# EAGLE design W104X (EAGLE 6.6.0)
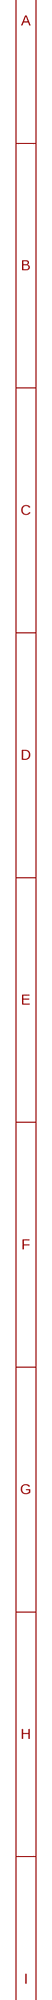
[diagram p0: schematic, sheet 1, part 1 of 2]
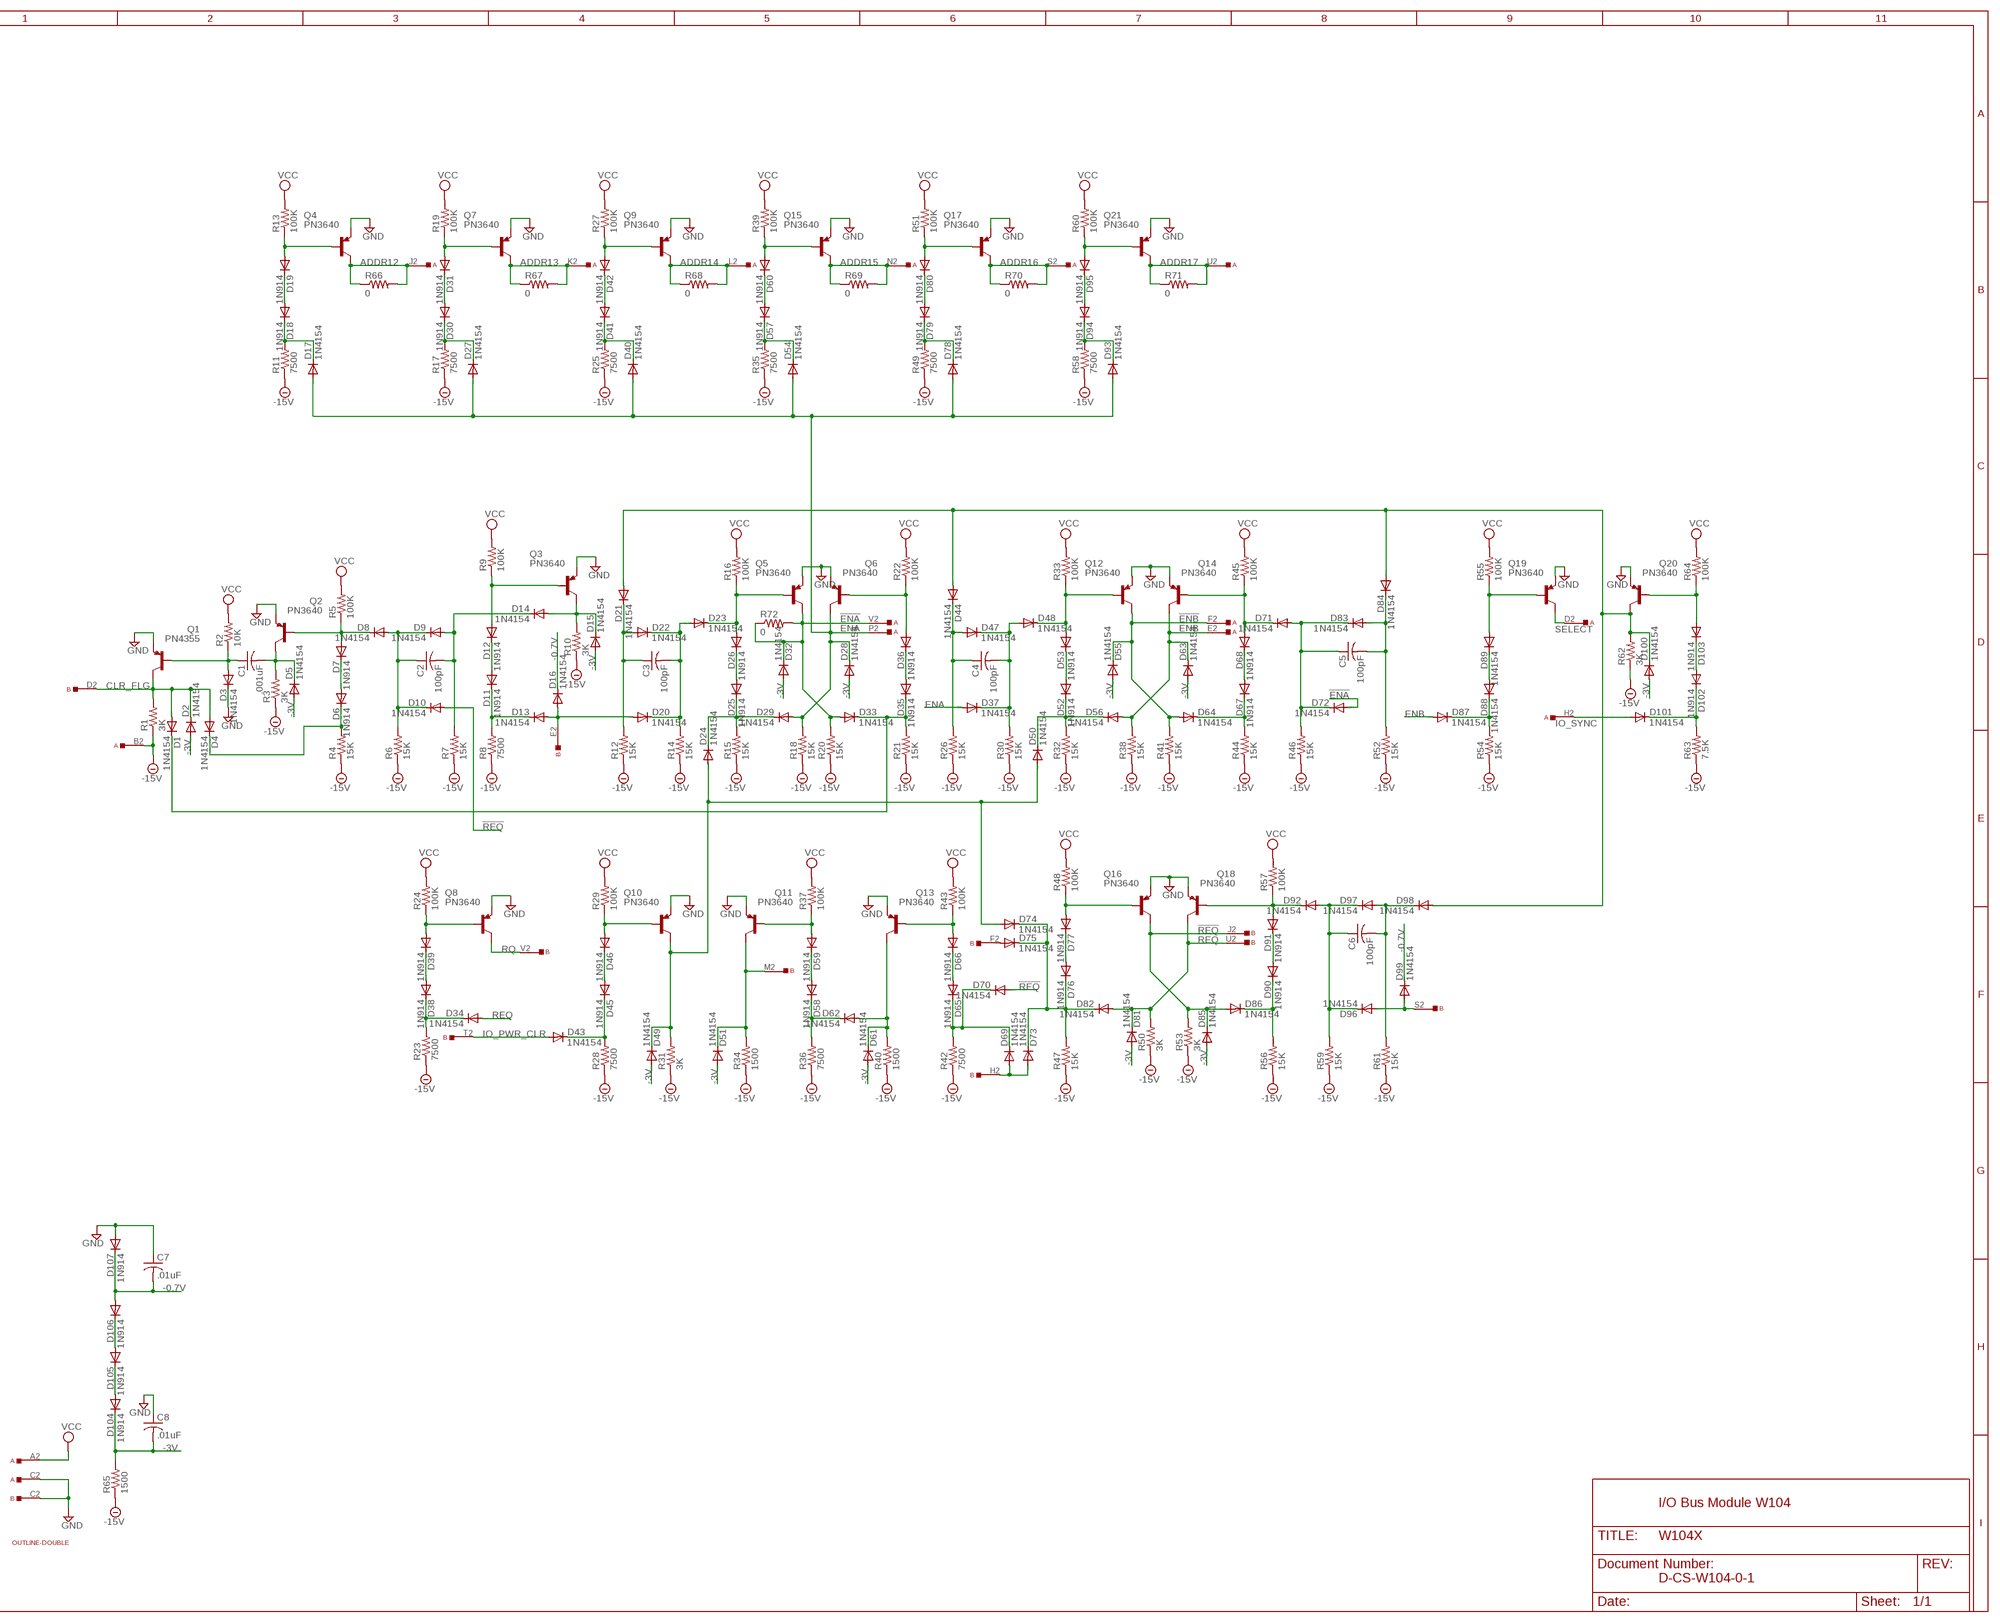
[diagram p1: schematic, sheet 1, part 2 of 2]

## Parts
A  SS-TOP  [EDGE-CON1]
B  SS-TOP  [EDGE-CON1]
C1  .001uF  C-US  [C063-025X075]
C2  100pF  C-US150-054X183  [C150-054X183]
C3  100pF  C-US150-054X183  [C150-054X183]
C4  100pF  C-US150-054X183  [C150-054X183]
C5  100pF  C-US150-054X183  [C150-054X183]
C6  100pF  C-US150-054X183  [C150-054X183]
C7  .01uF  C-US  [C063-025X075]
C8  .01uF  C-US  [C063-025X075]
D1  1N4154  DIODE-DO35-10  [DO35-10]
D2  1N4154  DIODE-DO35-10  [DO35-10]
D3  1N4154  DIODE-DO35-10  [DO35-10]
D4  1N4154  DIODE-DO35-10  [DO35-10]
D5  1N4154  DIODE-DO35-10  [DO35-10]
D6  1N914  DIODE-DO35-10  [DO35-10]
D7  1N914  DIODE-DO35-10  [DO35-10]
D8  1N4154  DIODE-DO35-10  [DO35-10]
D9  1N4154  DIODE-DO35-10  [DO35-10]
D10  1N4154  DIODE-DO35-10  [DO35-10]
D11  1N914  DIODE-DO35-10  [DO35-10]
D12  1N914  DIODE-DO35-10  [DO35-10]
D13  1N4154  DIODE-DO35-10  [DO35-10]
D14  1N4154  DIODE-DO35-10  [DO35-10]
D15  1N4154  DIODE-DO35-10  [DO35-10]
D16  1N4154  DIODE-DO35-10  [DO35-10]
D17  1N4154  DIODE-DO35-10  [DO35-10]
D18  1N914  DIODE-DO35-10  [DO35-10]
D19  1N914  DIODE-DO35-10  [DO35-10]
D20  1N4154  DIODE-DO35-10  [DO35-10]
D21  1N4154  DIODE-DO35-10  [DO35-10]
D22  1N4154  DIODE-DO35-10  [DO35-10]
D23  1N4154  DIODE-DO35-10  [DO35-10]
D24  1N4154  DIODE-DO35-10  [DO35-10]
D25  1N914  DIODE-DO35-10  [DO35-10]
D26  1N914  DIODE-DO35-10  [DO35-10]
D27  1N4154  DIODE-DO35-10  [DO35-10]
D28  1N4154  DIODE-DO35-10  [DO35-10]
D29  1N4154  DIODE-DO35-10  [DO35-10]
D30  1N914  DIODE-DO35-10  [DO35-10]
D31  1N914  DIODE-DO35-10  [DO35-10]
D32  1N4154  DIODE-DO35-10  [DO35-10]
D33  1N4154  DIODE-DO35-10  [DO35-10]
D34  1N4154  DIODE-DO35-10  [DO35-10]
D35  1N914  DIODE-DO35-10  [DO35-10]
D36  1N914  DIODE-DO35-10  [DO35-10]
D37  1N4154  DIODE-DO35-10  [DO35-10]
D38  1N914  DIODE-DO35-10  [DO35-10]
D39  1N914  DIODE-DO35-10  [DO35-10]
D40  1N4154  DIODE-DO35-10  [DO35-10]
D41  1N914  DIODE-DO35-10  [DO35-10]
D42  1N914  DIODE-DO35-10  [DO35-10]
D43  1N4154  DIODE-DO35-10  [DO35-10]
D44  1N4154  DIODE-DO35-10  [DO35-10]
D45  1N914  DIODE-DO35-10  [DO35-10]
D46  1N914  DIODE-DO35-10  [DO35-10]
D47  1N4154  DIODE-DO35-10  [DO35-10]
D48  1N4154  DIODE-DO35-10  [DO35-10]
D49  1N4154  DIODE-DO35-10  [DO35-10]
D50  1N4154  DIODE-DO35-10  [DO35-10]
D51  1N4154  DIODE-DO35-10  [DO35-10]
D52  1N914  DIODE-DO35-10  [DO35-10]
D53  1N914  DIODE-DO35-10  [DO35-10]
D54  1N4154  DIODE-DO35-10  [DO35-10]
D55  1N4154  DIODE-DO35-10  [DO35-10]
D56  1N4154  DIODE-DO35-10  [DO35-10]
D57  1N914  DIODE-DO35-10  [DO35-10]
D58  1N914  DIODE-DO35-10  [DO35-10]
D59  1N914  DIODE-DO35-10  [DO35-10]
D60  1N914  DIODE-DO35-10  [DO35-10]
D61  1N4154  DIODE-DO35-10  [DO35-10]
D62  1N4154  DIODE-DO35-10  [DO35-10]
D63  1N4154  DIODE-DO35-10  [DO35-10]
D64  1N4154  DIODE-DO35-10  [DO35-10]
D65  1N914  DIODE-DO35-10  [DO35-10]
D66  1N914  DIODE-DO35-10  [DO35-10]
D67  1N914  DIODE-DO35-10  [DO35-10]
D68  1N914  DIODE-DO35-10  [DO35-10]
D69  1N4154  DIODE-DO35-10  [DO35-10]
D70  1N4154  DIODE-DO35-10  [DO35-10]
D71  1N4154  DIODE-DO35-10  [DO35-10]
D72  1N4154  DIODE-DO35-10  [DO35-10]
D73  1N4154  DIODE-DO35-10  [DO35-10]
D74  1N4154  DIODE-DO35-10  [DO35-10]
D75  1N4154  DIODE-DO35-10  [DO35-10]
D76  1N914  DIODE-DO35-10  [DO35-10]
D77  1N914  DIODE-DO35-10  [DO35-10]
D78  1N4154  DIODE-DO35-10  [DO35-10]
D79  1N914  DIODE-DO35-10  [DO35-10]
D80  1N914  DIODE-DO35-10  [DO35-10]
D81  1N4154  DIODE-DO35-10  [DO35-10]
D82  1N4154  DIODE-DO35-10  [DO35-10]
D83  1N4154  DIODE-DO35-10  [DO35-10]
D84  1N4154  DIODE-DO35-10  [DO35-10]
D85  1N4154  DIODE-DO35-10  [DO35-10]
D86  1N4154  DIODE-DO35-10  [DO35-10]
D87  1N4154  DIODE-DO35-10  [DO35-10]
D88  1N4154  DIODE-DO35-10  [DO35-10]
D89  1N4154  DIODE-DO35-10  [DO35-10]
D90  1N914  DIODE-DO35-10  [DO35-10]
D91  1N914  DIODE-DO35-10  [DO35-10]
D92  1N4154  DIODE-DO35-10  [DO35-10]
D93  1N4154  DIODE-DO35-10  [DO35-10]
D94  1N914  DIODE-DO35-10  [DO35-10]
D95  1N914  DIODE-DO35-10  [DO35-10]
D96  1N4154  DIODE-DO35-10  [DO35-10]
D97  1N4154  DIODE-DO35-10  [DO35-10]
D98  1N4154  DIODE-DO35-10  [DO35-10]
D99  1N4154  DIODE-DO35-10  [DO35-10]
D100  1N4154  DIODE-DO35-10  [DO35-10]
D101  1N4154  DIODE-DO35-10  [DO35-10]
D102  1N914  DIODE-DO35-10  [DO35-10]
D103  1N914  DIODE-DO35-10  [DO35-10]
D104  1N914  DIODE-DO35-10  [DO35-10]
D105  1N914  DIODE-DO35-10  [DO35-10]
D106  1N914  DIODE-DO35-10  [DO35-10]
D107  1N914  DIODE-DO35-10  [DO35-10]
Q1  PN4355  -PNP-TO5  [TO5]
Q2  PN3640  -PNP-TO5  [TO5]
Q3  PN3640  -PNP-TO5  [TO5]
Q4  PN3640  -PNP-TO5  [TO5]
Q5  PN3640  -PNP-TO5  [TO5]
Q6  PN3640  -PNP-TO5  [TO5]
Q7  PN3640  -PNP-TO5  [TO5]
Q8  PN3640  -PNP-TO5  [TO5]
Q9  PN3640  -PNP-TO5  [TO5]
Q10  PN3640  -PNP-TO5  [TO5]
Q11  PN3640  -PNP-TO5  [TO5]
Q12  PN3640  -PNP-TO5  [TO5]
Q13  PN3640  -PNP-TO5  [TO5]
Q14  PN3640  -PNP-TO5  [TO5]
Q15  PN3640  -PNP-TO5  [TO5]
Q16  PN3640  -PNP-TO5  [TO5]
Q17  PN3640  -PNP-TO5  [TO5]
Q18  PN3640  -PNP-TO5  [TO5]
Q19  PN3640  -PNP-TO5  [TO5]
Q20  PN3640  -PNP-TO5  [TO5]
Q21  PN3640  -PNP-TO5  [TO5]
R1  3K  R-US_0207/10  [0207/10]
R2  10K  R-US_0207/10  [0207/10]
R3  3K  R-US_0207/10  [0207/10]
R4  15K  R-US_0207/10  [0207/10]
R5  100K  R-US_0207/10  [0207/10]
R6  15K  R-US_0207/10  [0207/10]
R7  15K  R-US_0207/10  [0207/10]
R8  7500  R-US_0207/10  [0207/10]
R9  100K  R-US_0207/10  [0207/10]
R10  3K  R-US_0207/10  [0207/10]
R11  7500  R-US_0207/10  [0207/10]
R12  15K  R-US_0207/10  [0207/10]
R13  100K  R-US_0207/10  [0207/10]
R14  15K  R-US_0207/10  [0207/10]
R15  15K  R-US_0207/10  [0207/10]
R16  100K  R-US_0207/10  [0207/10]
R17  7500  R-US_0207/10  [0207/10]
R18  15K  R-US_0207/10  [0207/10]
R19  100K  R-US_0207/10  [0207/10]
R20  15K  R-US_0207/10  [0207/10]
R21  15K  R-US_0207/10  [0207/10]
R22  100K  R-US_0207/10  [0207/10]
R23  7500  R-US_0207/10  [0207/10]
R24  100K  R-US_0207/10  [0207/10]
R25  7500  R-US_0207/10  [0207/10]
R26  15K  R-US_0207/10  [0207/10]
R27  100K  R-US_0207/10  [0207/10]
R28  7500  R-US_0207/10  [0207/10]
R29  100K  R-US_0207/10  [0207/10]
R30  15K  R-US_0207/10  [0207/10]
R31  3K  R-US_0207/10  [0207/10]
R32  15K  R-US_0207/10  [0207/10]
R33  100K  R-US_0207/10  [0207/10]
R34  1500  R-US_0207/10  [0207/10]
R35  7500  R-US_0207/10  [0207/10]
R36  7500  R-US_0207/10  [0207/10]
R37  100K  R-US_0207/10  [0207/10]
R38  15K  R-US_0207/10  [0207/10]
R39  100K  R-US_0207/10  [0207/10]
R40  1500  R-US_0207/10  [0207/10]
R41  15K  R-US_0207/10  [0207/10]
R42  7500  R-US_0207/10  [0207/10]
R43  100K  R-US_0207/10  [0207/10]
R44  15K  R-US_0207/10  [0207/10]
R45  100K  R-US_0207/10  [0207/10]
R46  15K  R-US_0207/10  [0207/10]
R47  15K  R-US_0207/10  [0207/10]
R48  100K  R-US_0207/10  [0207/10]
R49  7500  R-US_0207/10  [0207/10]
R50  3K  R-US_0207/10  [0207/10]
R51  100K  R-US_0207/10  [0207/10]
R52  15K  R-US_0207/10  [0207/10]
R53  3K  R-US_0207/10  [0207/10]
R54  15K  R-US_0207/10  [0207/10]
R55  100K  R-US_0207/10  [0207/10]
R56  15K  R-US_0207/10  [0207/10]
R57  100K  R-US_0207/10  [0207/10]
R58  7500  R-US_0207/10  [0207/10]
R59  15K  R-US_0207/10  [0207/10]
R60  100K  R-US_0207/10  [0207/10]
R61  15K  R-US_0207/10  [0207/10]
R62  3K  R-US_0207/10  [0207/10]
R63  7.5K  R-US_0207/10  [0207/10]
R64  100K  R-US_0207/10  [0207/10]
R65  1500  R-US_0207/10  [0207/10]
R66  0  R-US_0207/10  [0207/10]
R67  0  R-US_0207/10  [0207/10]
R68  0  R-US_0207/10  [0207/10]
R69  0  R-US_0207/10  [0207/10]
R70  0  R-US_0207/10  [0207/10]
R71  0  R-US_0207/10  [0207/10]
R72  0  R-US_0207/10  [0207/10]
U$1  OUTLINE-DOUBLE  [DOUBLE]

## Nets
!ENA: A.V2 D32.C D33.A D72.A Q5.3(C) R20.2 R72.1 R72.2
!ENB: A.F2 D55.C D64.A Q12.3(C) R41.2
!REQ: B.J2 D10.A D70.A D85.C D86.A Q16.3(C) R53.2
-0.7V: C7.2 D16.C D99.C D106.A D107.C
-3V: C8.2 D2.A D5.A D15.A D28.A D32.A D49.A D51.A D55.A D61.A D63.A D81.A D85.A D100.A D104.C R65.2
-15V: A.B2 R1.1 R3.1 R4.1 R6.1 R7.1 R8.1 R10.1 R11.1 R12.1 R14.1 R15.1 R17.1 R18.1 R20.1 R21.1 R23.1 R25.1 R26.1 R28.1 R30.1 R31.1 R32.1 R34.1 R35.1 R36.1 R38.1 R40.1 R41.1 R42.1 R44.1 R46.1 R47.1 R49.1 R50.1 R52.1 R53.1 R54.1 R56.1 R58.1 R59.1 R61.1 R62.1 R63.1 R65.1
ADDR12: A.J2 Q4.3(C) R66.1 R66.2
ADDR13: A.K2 Q7.3(C) R67.1 R67.2
ADDR14: A.L2 Q9.3(C) R68.1 R68.2
ADDR15: A.N2 Q15.3(C) R69.1 R69.2
ADDR16: A.S2 Q17.3(C) R70.1 R70.2
ADDR17: A.U2 Q21.3(C) R71.1 R71.2
CLR_FLG: B.D2 D1.A D2.C D4.A Q1.3(C) R1.2
ENA: A.P2 D17.A D27.A D28.C D29.A D37.A D40.A D54.A D78.A D93.A Q6.3(C) R18.2
ENB: A.E2 D56.A D63.C D87.A Q14.3(C) R38.2
GND [supply]: A.C2 B.C2 C7.1 C8.1 D3.C D107.A Q1.1(E) Q2.1(E) Q3.1(E) Q4.1(E) Q5.1(E) Q6.1(E) Q7.1(E) Q8.1(E) Q9.1(E) Q10.1(E) Q11.1(E) Q12.1(E) Q13.1(E) Q14.1(E) Q15.1(E) Q16.1(E) Q17.1(E) Q18.1(E) Q19.1(E) Q20.1(E) Q21.1(E)
IO_PWR_CLR: B.T2 D43.A
IO_SYNC: A.H2 D101.A
N$1: D19.A Q4.2(B) R13.1
N$2: C1.1 D3.A Q1.2(B) R2.1
N$3: D1.C D33.C D35.C R21.2
N$4: D4.C D6.C R4.2
N$5: C1.2 D5.C Q2.3(C) R3.2
N$6: D7.A D8.C Q2.2(B) R5.1
N$7: D6.A D7.C
N$8: C2.2 D9.A D14.C R7.2
N$9: C2.1 D8.A D9.C D10.C R6.2
N$10: C6.1 D92.A D96.C D97.C R59.2
N$11: D11.A D12.C
N$12: D11.C D13.C R8.2
N$13: D12.A Q3.2(B) R9.1
N$14: D14.A D15.C Q3.3(C) R10.2
N$15: B.E2 D13.A D16.A D20.A
N$16: D60.A Q15.2(B) R39.1
N$17: C3.2 D20.C D22.C D23.A R14.2
N$18: D17.C D18.C R11.2
N$19: D18.A D19.C
N$20: D36.A Q6.2(B) R22.1
N$21: D27.C D30.C R17.2
N$22: D30.A D31.C
N$23: D31.A Q7.2(B) R19.1
N$24: D42.A Q9.2(B) R27.1
N$25: D41.A D42.C
N$26: D40.C D41.C R25.2
N$27: D57.A D60.C
N$28: D54.C D57.C R35.2
N$29: D80.A Q17.2(B) R51.1
N$30: D79.A D80.C
N$31: D78.C D79.C R49.2
N$32: D95.A Q21.2(B) R60.1
N$33: D94.A D95.C
N$34: D93.C D94.C R58.2
N$35: C3.1 D21.C D22.A R12.2
N$36: D23.C D26.A Q5.2(B) R16.1
N$37: D24.C D25.C D29.C R15.2
N$38: D21.A D44.A D84.A D98.A D100.C Q20.3(C) R62.2
N$39: D25.A D26.C
N$40: D24.A D49.C D50.A D74.A Q10.3(C) R31.2
N$41: D39.A Q8.2(B) R24.1
N$42: D38.A D39.C
N$43: D34.C D38.C R23.2
N$44: D43.C D45.C R28.2
N$46: D45.A D46.C
N$47: D46.A Q10.2(B) R29.1
N$48: B.M2 D51.C Q11.3(C) R34.2
N$49: D59.A Q11.2(B) R37.1
N$50: D58.A D59.C
N$51: D58.C D62.C R36.2
N$52: D61.C D62.A Q13.3(C) R40.2
N$53: D66.A Q13.2(B) R43.1
N$54: D65.A D66.C
N$55: D65.C D69.C D70.C R42.2
N$56: B.H2 D69.A D73.A
N$57: B.F2 D75.A
N$58: D77.A Q16.2(B) R48.1
N$59: D76.A D77.C
N$60: D73.C D74.C D75.C D76.C D82.C R47.2
N$61: D91.A D92.C Q18.2(B) R57.1
N$62: D90.A D91.C
N$63: D105.A D106.C
N$64: D68.A D71.C Q14.2(B) R45.1
N$65: D35.A D36.C
N$66: D104.A D105.C
N$67: D102.A D103.C
N$68: D101.C D102.C R63.2
N$69: D103.A Q20.2(B) R64.1
N$70: B.S2 D96.A D99.A
N$71: D86.C D90.C R56.2
N$72: D48.C D53.A Q12.2(B) R33.1
N$73: C4.1 D44.C D47.A R26.2
N$74: C4.2 D37.C D47.C D48.A R30.2
N$75: D67.A D68.C
N$76: D52.A D53.C
N$77: D50.C D52.C D56.C R32.2
N$78: D64.C D67.C R44.2
N$79: C5.1 D71.A D72.C D83.C R46.2
N$80: D89.A Q19.2(B) R55.1
N$81: C5.2 D83.A D84.C R52.2
N$82: D87.C D88.C R54.2
N$83: D88.A D89.C
N$85: C6.2 D97.A D98.C R61.2
REQ: B.U2 D34.A D81.C D82.A Q18.3(C) R50.2
RQ: B.V2 Q8.3(C)
SELECT: A.D2 Q19.3(C)
VCC [supply]: A.A2 R2.2 R5.2 R9.2 R13.2 R16.2 R19.2 R22.2 R24.2 R27.2 R29.2 R33.2 R37.2 R39.2 R43.2 R45.2 R48.2 R51.2 R55.2 R57.2 R60.2 R64.2
Unconnected: A.M2 A.R2 A.T2 B.A2 B.B2 B.K2 B.L2 B.N2 B.P2 B.R2

## Notes on the sheet
- I/O Bus Module W104
- D-CS-W104-0-1

## Library data of the parts
A B = dec-con:SS-TOP: Single Sided Top Connector. Also suitable for building wider single-sided modules.
C1 C7 C8 = dec-con:C-US: Capacitors with funky DEC lead spacing.
C2-C6 = rcl:C-US: CAPACITOR, American symbol
D1-D107 = diode:DIODE-: DIODE
Q1-Q21 = transistor:*-PNP-: PNP Transistror
R1-R72 = rcl:R-US_: RESISTOR, American symbol
U$1 = dec-con:OUTLINE-*: Board outlines for DEC boards.

## Net classes
1 supply: width 0.813 mm

## Board
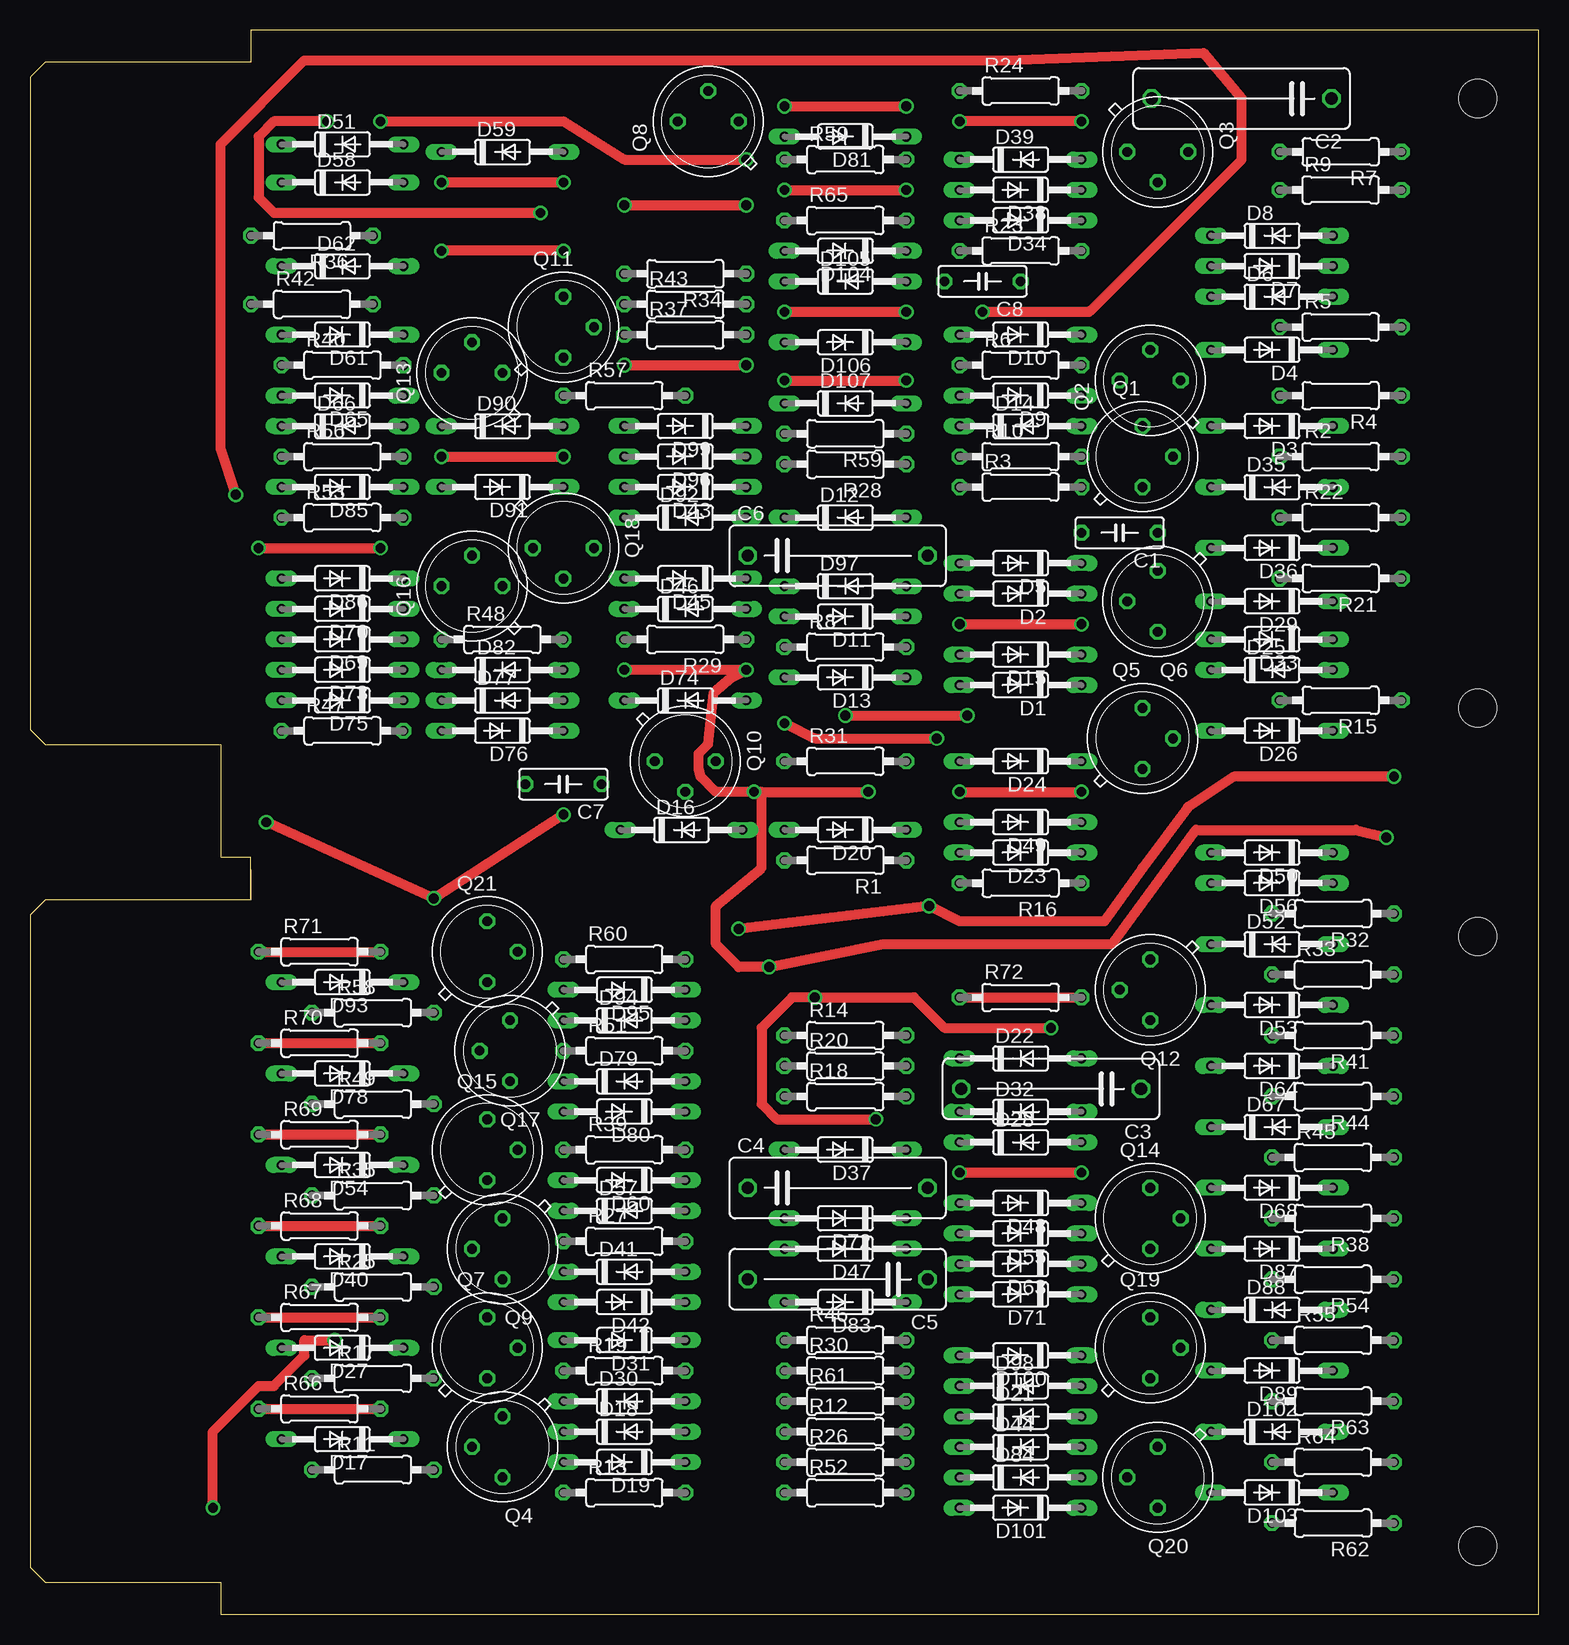
[diagram p2: board, top side]
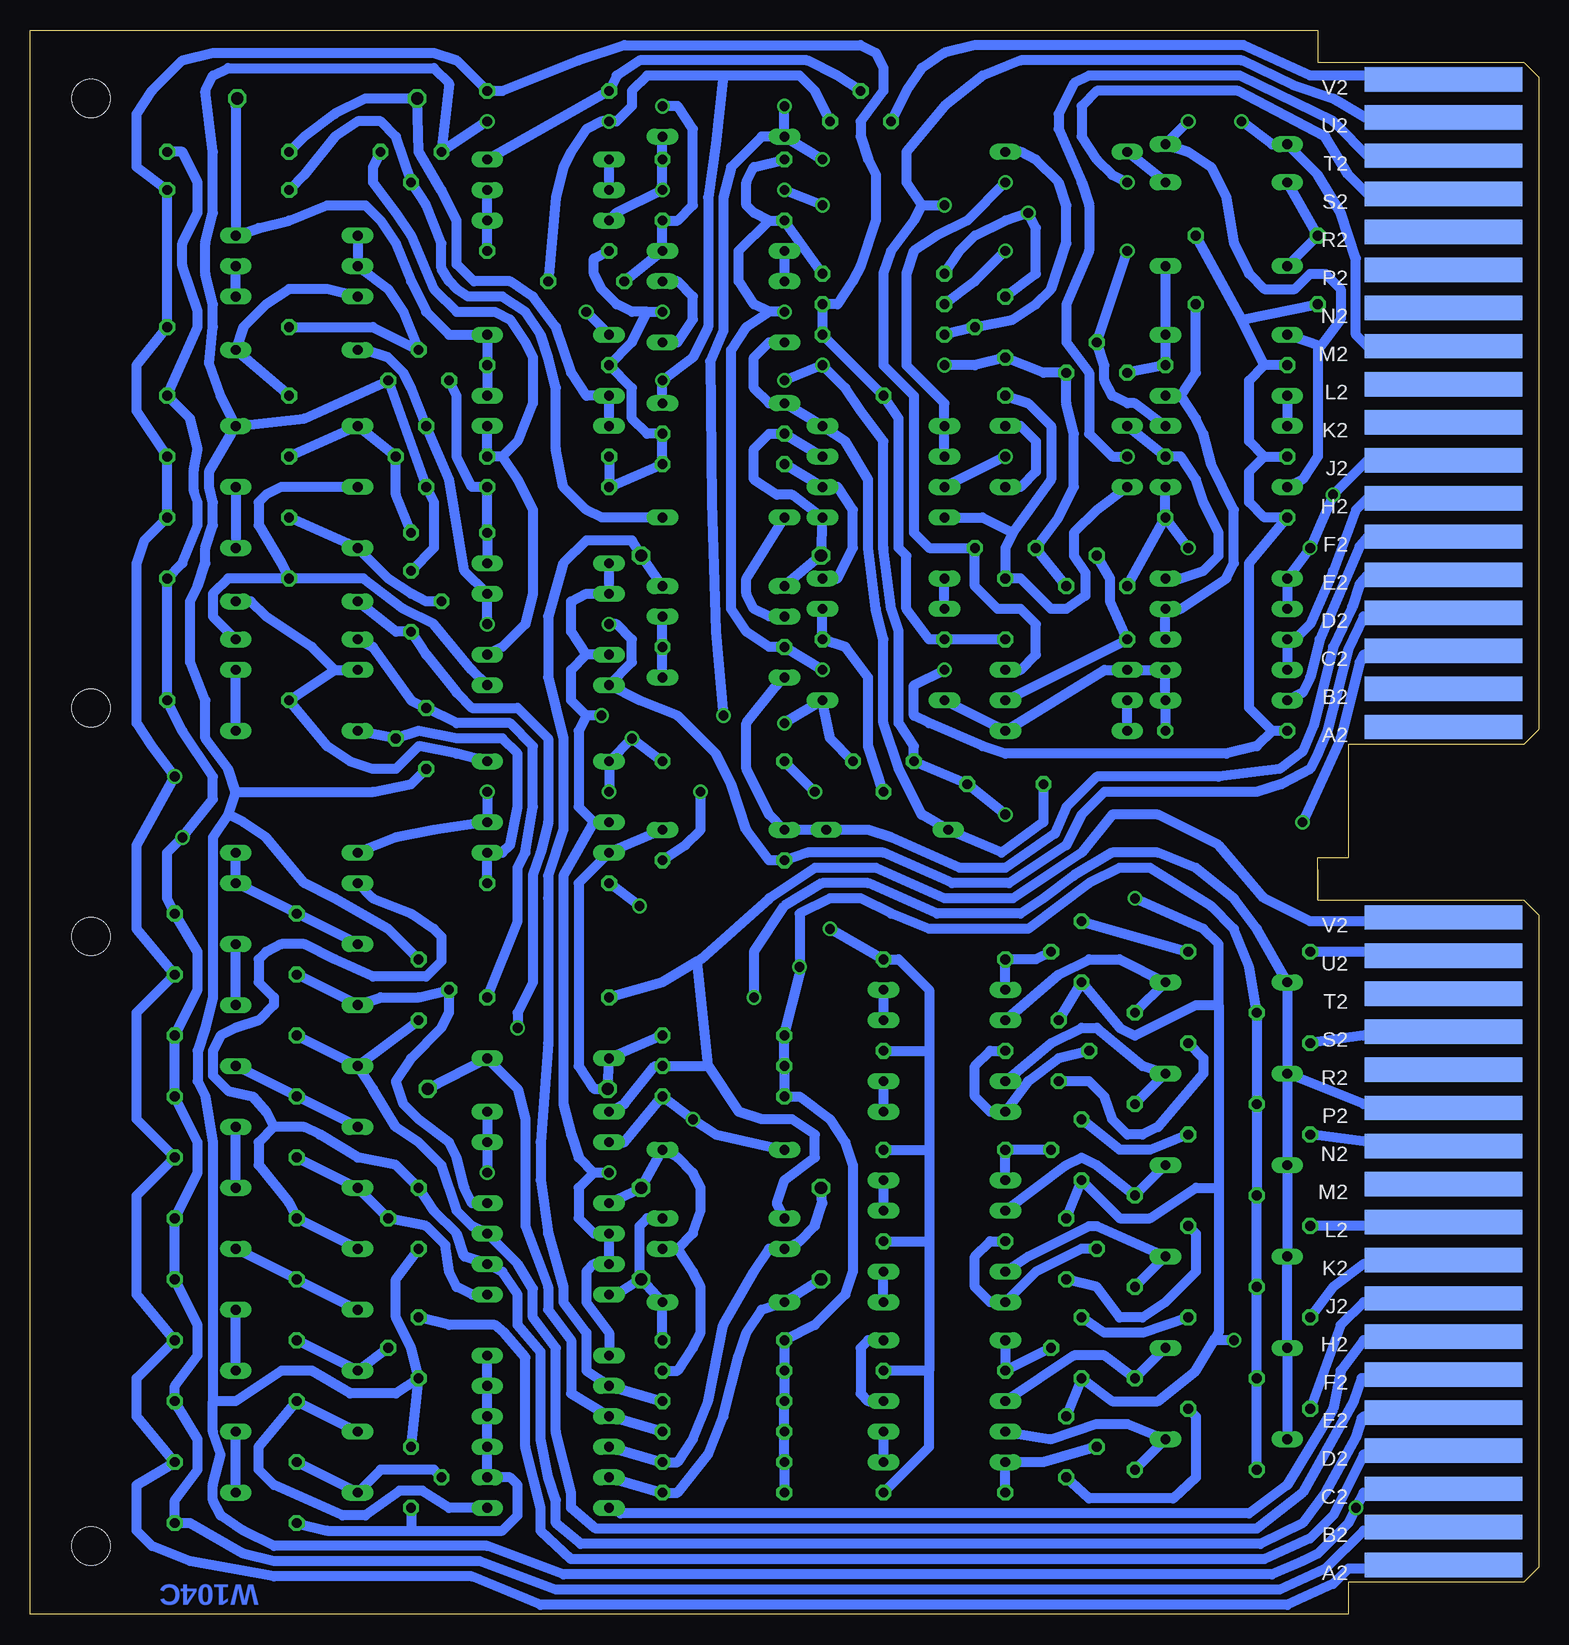
[diagram p3: board, bottom side, seen from below]

Size 125.73 x 132.08 mm. Coordinates in mm from the lower left corner, seen from the top.
Copper layers (1+16): Top 0.035mm / dielectric 1.5mm / Bottom 0.035mm
Design rules "16mils": minimum track width 16mil, minimum drill 32mil, track to track 15mil, track to pad 10mil, pad to pad 10mil, via to via 10mil, smd to smd 10mil, copper to edge 13mil, drill to drill 10mil, minimum pad ring 10mil, minimum via ring 8mil, stop-mask expansion 0mil, vias tented up to drill 0mil, thermal gap 10mil

### Footprints (pad centres in the part's own frame; a part is rotated, then mirrored left to right if it is on the bottom)
EDGE-CON1 = smd 13.106 x 2.032 bottom: A2 7.938,4.128; B2 7.938,7.303; C2 7.938,10.477; D2 7.938,13.652; E2 7.938,16.828; F2 7.938,20.003; H2 7.938,23.177; J2 7.938,26.352; K2 7.938,29.527; L2 7.938,32.703; M2 7.938,35.877; N2 7.938,39.053; P2 7.938,42.227; R2 7.938,45.403; S2 7.938,48.578; T2 7.938,51.752; U2 7.938,54.928; V2 7.938,58.102
C063-025X075 = drill 0.813 octagon: 1 -2.54,0; 2 3.81,0
C150-054X183 = drill 1.016 octagon: 1 -7.493,0; 2 7.493,0
DO35-10 = drill 0.813 long: A 5.08,0; C -5.08,0
TO5 = drill 0.813 octagon: 1 0,-2.54; 2 2.54,0; 3 0,2.54
0207/10 = drill 0.813 octagon: 1 -5.08,0; 2 5.08,0
DOUBLE = hole 3.175: 120.65,56.515; 120.65,5.715; 120.65,75.565; 120.65,126.365

### Placement (x,y rotation side)
A  0,0 0 top
B  0,69.85 0 top
C1  91.44,90.17 180 top
C2  100.97,126.36 180 top
C3  85.09,43.81 180 top
C4  67.31,35.56 0 top
C5  67.31,27.94 180 top
C6  67.31,88.27 0 top
C7  45.09,69.22 180 top
C8  80.01,111.12 180 top
D1  82.55,77.47 180 top
D2  82.55,85.09 180 top
D3  103.51,99.06 180 top
D4  103.51,105.41 180 top
D5  82.55,87.63 180 top
D6  103.51,109.86 0 top
D7  103.51,112.39 180 top
D8  103.51,114.94 0 top
D9  82.55,101.6 180 top
D10  82.55,106.68 180 top
D11  67.95,83.19 180 top
D12  67.95,91.44 0 top
D13  67.95,78.11 180 top
D14  82.55,99.06 0 top
D15  82.55,80.01 180 top
D16  54.29,65.41 0 top
D17  26.04,14.61 180 top
D18  49.53,15.24 0 top
D19  49.53,12.7 180 top
D20  67.95,65.41 180 top
D21  82.55,16.51 0 top
D22  82.55,46.35 0 top
D23  82.55,63.5 180 top
D24  82.55,71.12 180 top
D25  103.51,78.74 0 top
D26  103.51,73.66 180 top
D27  26.04,22.23 180 top
D28  82.55,39.37 0 top
D29  103.51,84.45 180 top
D30  49.53,17.78 0 top
D31  49.53,22.86 180 top
D32  82.55,41.91 0 top
D33  103.51,81.28 180 top
D34  82.55,116.2 180 top
D35  103.51,93.98 0 top
D36  103.51,88.9 180 top
D37  67.95,38.73 180 top
D38  82.55,118.75 180 top
D39  82.55,121.28 0 top
D40  26.04,29.84 180 top
D41  49.53,28.57 0 top
D42  49.53,26.04 180 top
D43  54.61,93.98 180 top
D44  82.55,13.97 0 top
D45  54.61,86.36 180 top
D46  54.61,83.82 0 top
D47  67.95,30.48 180 top
D48  82.55,34.29 180 top
D49  82.55,66.04 180 top
D50  103.51,63.5 180 top
D51  26.04,122.56 0 top
D52  103.51,55.88 0 top
D53  103.51,50.8 180 top
D54  26.04,37.47 180 top
D55  82.55,31.75 180 top
D56  103.51,60.96 180 top
D57  49.53,33.66 0 top
D58  26.04,119.38 0 top
D59  39.37,121.92 0 top
D60  49.53,36.2 180 top
D61  26.04,106.68 180 top
D62  26.04,112.39 0 top
D63  82.55,29.21 180 top
D64  103.51,45.72 180 top
D65  26.04,101.6 180 top
D66  26.04,99.06 0 top
D67  103.51,40.64 0 top
D68  103.51,35.56 180 top
D69  26.04,81.28 180 top
D70  26.04,83.82 180 top
D71  82.55,26.67 180 top
D72  67.95,33.02 180 top
D73  26.04,78.74 180 top
D74  54.61,76.2 0 top
D75  26.04,76.2 180 top
D76  39.37,73.66 180 top
D77  39.37,76.2 0 top
D78  26.04,45.09 180 top
D79  49.53,44.45 0 top
D80  49.53,41.91 180 top
D81  67.95,123.19 180 top
D82  39.37,78.74 0 top
D83  67.95,26.04 180 top
D84  82.55,11.43 0 top
D85  26.04,93.98 180 top
D86  26.04,86.36 180 top
D87  103.51,30.48 180 top
D88  103.51,25.4 0 top
D89  103.51,20.32 180 top
D90  39.37,99.06 0 top
D91  39.37,93.98 180 top
D92  54.61,91.44 0 top
D93  26.04,52.7 180 top
D94  49.53,49.53 0 top
D95  49.53,52.07 180 top
D96  54.61,96.52 180 top
D97  67.95,85.72 0 top
D98  82.55,19.05 0 top
D99  54.61,99.06 180 top
D100  82.55,21.59 180 top
D101  82.55,8.89 180 top
D102  103.51,15.24 0 top
D103  103.51,10.16 180 top
D104  67.95,113.67 180 top
D105  67.95,111.12 0 top
D106  67.95,106.05 180 top
D107  67.95,100.97 0 top
Q1  92.71,96.52 0 top
Q2  93.35,102.87 90 top
Q3  93.98,121.92 270 top
Q4  39.37,13.97 180 top
Q5  92.71,73.03 0 top
Q6  93.98,84.45 180 top
Q7  38.1,22.23 0 top
Q8  56.52,124.46 90 top
Q9  39.37,30.48 180 top
Q10  54.61,71.12 270 top
Q11  44.45,107.31 0 top
Q12  93.35,52.07 180 top
Q13  36.83,103.5 90 top
Q14  93.35,33.02 0 top
Q15  38.1,38.73 0 top
Q16  36.83,85.72 90 top
Q17  40.01,46.99 180 top
Q18  44.45,88.9 270 top
Q19  93.35,22.23 0 top
Q20  93.98,11.43 180 top
Q21  38.1,55.24 0 top
R1  67.95,62.87 180 top
R2  109.22,96.52 0 top
R3  82.55,93.98 0 top
R4  109.22,101.6 180 top
R5  109.22,107.31 0 top
R6  82.55,104.14 0 top
R7  109.22,121.92 180 top
R8  67.95,80.64 0 top
R9  109.22,118.75 0 top
R10  82.55,96.52 0 top
R11  28.58,12.06 0 top
R12  67.95,15.24 0 top
R13  49.53,10.16 0 top
R14  67.95,48.26 0 top
R15  109.22,76.2 180 top
R16  82.55,60.96 180 top
R17  28.58,19.68 0 top
R18  67.95,43.18 0 top
R19  49.53,20.32 0 top
R20  67.95,45.72 0 top
R21  109.22,86.36 180 top
R22  109.22,91.44 0 top
R23  82.55,113.67 0 top
R24  82.55,127 0 top
R25  28.58,27.3 0 top
R26  67.95,12.7 0 top
R27  49.53,31.11 0 top
R28  67.95,95.89 180 top
R29  54.61,81.28 180 top
R30  67.95,20.32 0 top
R31  67.95,71.12 0 top
R32  108.59,58.42 180 top
R33  108.59,53.34 0 top
R34  54.61,111.76 180 top
R35  28.58,34.92 0 top
R36  23.5,114.94 180 top
R37  54.61,106.68 0 top
R38  108.59,33.02 180 top
R39  49.53,38.73 0 top
R40  26.04,104.14 0 top
R41  108.59,48.26 180 top
R42  23.5,109.22 0 top
R43  54.61,109.22 0 top
R44  108.59,43.18 180 top
R45  108.59,38.1 0 top
R46  67.95,22.86 0 top
R47  26.04,73.66 0 top
R48  39.37,81.28 0 top
R49  28.58,42.55 0 top
R50  67.95,121.28 0 top
R51  49.53,46.99 0 top
R52  67.95,10.16 0 top
R53  26.04,91.44 0 top
R54  108.59,27.94 180 top
R55  108.59,22.86 0 top
R56  26.04,96.52 0 top
R57  49.53,101.6 0 top
R58  28.58,50.16 0 top
R59  67.95,98.42 180 top
R60  49.53,54.61 0 top
R61  67.95,17.78 0 top
R62  108.59,7.62 180 top
R63  108.59,17.78 180 top
R64  108.59,12.7 0 top
R65  67.95,116.2 0 top
R66  24.13,17.14 0 top
R67  24.13,24.77 0 top
R68  24.13,32.38 0 top
R69  24.13,40.01 0 top
R70  24.13,47.62 0 top
R71  24.13,55.24 0 top
R72  82.55,51.44 0 top
U$1  0,0 0 top

### Tracks (layer width: path | path; a pad name or v marks a point on that pad's centre or on a via)
!ENA
  Top 0.813: R72.1 R72.2
  Bottom 0.813: A.V2 8.89,57.78 19.05,57.78 22.86,59.69 26.67,64.14 31.75,66.67 35.56,66.67 38.1,63.5 43.82,59.69 49.53,59.69 55.25,62.23 60.33,62.23 64.14,59.69 69.85,54.61 70.13,54.44 | 70.13,54.44 73.03,52.7 R72.1 | R72.2 85.09,57.78 85.09,62.23 84.46,63.5 83.82,67.31 83.82,72.39 85.73,74.3 90.17,74.3 Q5.3 93.98,76.2 97.16,80.64 D33.A | 69.22,45.72 R20.2 73.66,45.72 76.2,42.55 D32.C | 69.22,45.72 70.13,54.44 | 69.22,45.72 66.68,41.91 64.77,41.27 62.23,41.27 60.33,40.01 60.33,38.1 62.87,36.2 63.5,34.29 D72.A
!ENB
  Bottom 0.813: A.F2 8.26,19.68 14.76,19.68 15.4,17.78 19.69,10.16 23.5,7.14 78.58,7.14 80.65,8.89 80.65,10.16 81.92,15.24 81.92,22.23 83.82,24.77 83.82,27.15 85.09,29.21 D55.C 88.9,32.38 90.17,33.66 91.44,37.47 93.35,39.37 95.25,40.64 97.16,43.81 D64.A | D64.A Q12.3 | R41.2 D64.A
!REQ  (via drill 0.81, 0.81 pad 0.25)
  Top 0.813: v19.05,88.9 v29.21,88.9 | v17.15,93.34 15.88,97.16 15.88,122.56 22.86,129.54 81.28,129.54 97.79,130.18 100.97,126.36 100.97,126.31 | v79.38,108.58 88.16,108.58 arc45 88.34,108.66 100.97,121.28 100.97,126.31 | 100.97,126.31 arc45 100.89,126.49 100.71,126.68
  Bottom 0.813: B.J2 8.89,96.2 8.89,96.52 13.97,96.52 v17.15,93.34 v19.05,88.9 D86.A D70.A | Q16.3 R53.2 | R53.2 D85.C | v29.21,88.9 R53.2 | D10.A v79.38,108.58
-0.7V
  Bottom 0.813: C7.2 41.28,66.04 44.77,63.5 D16.C 51.44,66.67 53.34,70.48 54.61,74.3 54.61,81.28 55.25,83.82 55.88,88.9 55.88,94.61 57.79,97.79 D99.C D107.C 64.14,100.97 65.41,102.23 65.41,104.78 64.14,106.05 D106.A
-3V  (via drill 0.81, 0.81 pad 0.25)
  Top 0.813: v29.21,124.46 44.45,124.46 49.53,121.28 v59.69,121.28 | v62.87,125.73 v73.03,125.73 | v67.95,74.93 v78.11,74.93 | v87.63,36.83 v77.47,36.83
  Bottom 0.813: v29.21,124.46 D51.A 29.21,121.92 27.31,120.65 26.04,118.11 25.4,114.3 24.13,111.76 22.86,110.49 20.32,110.49 19.05,111.76 17.78,111.76 16.51,110.49 16.51,107.95 18.19,105.72 | v59.69,121.28 D81.A | D81.A v62.87,125.73 | 18.19,105.72 18.42,105.41 18.42,96.52 19.69,94.61 D85.A | D61.A 18.19,105.72 | D81.A 64.77,123.19 67.31,120.65 67.95,118.11 67.95,107 69.06,104.46 68.9,92.71 68.58,81.92 v67.95,74.93 | v73.03,125.73 71.76,125.73 70.49,123.83 70.49,117.47 71.76,116.2 R65.2 D104.C C8.2 | 79.38,74.93 80.65,76.2 80.65,78.74 79.38,80.01 | D15.A 79.38,80.01 | 79.38,80.01 80.65,81.92 80.65,84.45 79.38,85.09 D2.A D5.A | v78.11,74.93 79.38,74.93 | 79.38,74.93 80.01,73.66 80.01,67.31 78.74,66.04 | D49.A 78.74,66.04 | 78.74,66.04 81.28,61.59 81.28,42.55 80.65,40.01 80.01,38.1 78.74,36.83 | v77.47,36.83 78.74,36.83 | 78.74,36.83 80.01,35.56 80.01,33.02 78.74,31.75 D55.A D63.A 78.74,29.21 79.38,28.57 79.38,26.04 77.47,23.5 D100.A | v87.63,36.83 D28.A D32.A
-15V  (via drill 0.81, 0.81 pad 0.25)
  Top 0.813: 60.96,68.58 60.96,62.23 57.15,59.05 57.15,55.88 59.06,53.98 v61.6,53.98 71.12,55.88 90.17,55.88 97.16,65.41 110.49,65.41 v113.03,64.77 | 60.96,68.58 v60.33,68.58 57.15,68.58 55.88,69.85 55.72,70.48 55.72,71.75 56.52,72.55 56.99,76.83 58.42,78.11 v59.69,78.74 v49.53,78.74 | 60.96,68.58 v69.85,68.58 | v62.87,108.58 v73.03,108.58
  Bottom 0.813: R11.1 R17.1 R25.1 R35.1 R49.1 R58.1 24.13,53.98 25.4,57.15 27.31,59.05 32.39,62.23 34.93,62.23 37.47,60.96 42.55,57.15 50.8,57.15 53.98,58.42 56.52,59.69 59.06,59.69 61.6,58.42 v61.6,53.98 61.6,53.34 R14.1 R20.1 R18.1 61.6,43.18 59.06,41.27 57.79,39.37 57.15,37.47 57.15,28.57 57.79,26.67 60.33,24.13 R46.1 R30.1 R61.1 R12.1 R26.1 R52.1 | A.B2 8.89,6.99 14.61,6.99 17.78,3.81 21.59,2.06 81.92,2.06 88.27,4.45 105.41,4.45 107.95,5.08 112.4,7.62 R62.1 113.67,9.53 111.76,12.06 111.76,14.61 R63.1 113.67,19.05 111.76,21.59 111.76,24.13 R54.1 R38.1 111.76,36.83 111.76,39.37 R44.1 R41.1 111.76,52.07 111.76,55.24 R32.1 114.3,59.69 114.3,63.5 v113.03,64.77 110.49,67.94 110.49,69.85 113.03,73.66 R15.1 R21.1 113.03,87.63 111.76,90.81 111.76,92.71 112.08,93.66 112.08,95.41 111.76,97.16 112.4,99.69 R4.1 111.76,107.31 111.76,108.58 113.03,112.39 113.03,114.3 111.76,116.84 111.76,119.38 113.03,121.92 R7.1 | R47.1 22.23,73.66 | 22.23,73.66 24.13,75.56 24.13,87.63 R53.1 22.86,91.44 24.13,92.71 24.13,95.25 22.86,96.52 | 22.86,96.52 24.13,97.79 24.13,102.87 22.86,104.14 | 22.86,104.14 24.77,107.95 | 24.77,107.95 R42.1 | 24.77,107.95 R36.1 | R34.1 R65.1 64.14,116.2 | 22.23,73.66 23.5,72.39 26.04,71.75 44.45,71.75 46.36,72.39 50.8,74.3 52.07,74.93 52.07,77.47 v49.53,78.74 | R1.1 71.12,64.14 69.85,65.41 v69.85,68.58 | v59.69,78.74 R8.1 64.14,80.64 66.04,81.92 67.31,83.82 67.31,105.41 66.04,107.31 64.14,108.58 | v62.87,108.58 64.14,108.58 | 64.14,108.58 65.41,109.22 66.68,111.12 66.68,113.67 64.14,116.2 | 64.14,116.2 65.41,116.84 66.04,117.47 66.04,119.38 65.41,120.65 R50.1
  Bottom 0.813: 74.3,108.58 75.57,106.05 R6.1 75.57,102.23 75.57,99.69 74.3,98.42 R59.1 R28.1 R3.1 R10.1 | 74.3,108.58 v73.03,108.58 | 74.3,108.58 75.57,108.58 76.84,109.22 78.11,110.49 78.74,111.76 78.74,113.03 R23.1 | 22.86,96.52 R56.1 | v60.33,68.58 R31.1 | R40.1 22.86,104.14
ADDR12
  Top 0.813: R66.1 R66.2
  Bottom 0.813: R66.2 28.58,16.51 28.58,11.43 30.48,9.68 37.47,9.68 Q4.3 | A.J2 8.89,26.04 14.61,26.04 16.51,24.13 R66.1
ADDR13
  Top 0.813: R67.1 R67.2
  Bottom 0.813: A.K2 8.26,29.21 14.61,29.21 17.15,27.3 R67.1 | R67.2 33.02,23.5 36.2,23.5 Q7.3
ADDR14
  Top 0.813: R68.1 R68.2
  Bottom 0.813: A.L2 6.99,32.38 R68.1 | R68.2 28.58,31.75 28.58,28.57 31.12,26.04 33.02,24.77 34.93,24.77 36.83,27.3 Q9.3
ADDR15
  Top 0.813: R69.1 R69.2
  Bottom 0.813: A.N2 8.26,39.37 13.97,39.37 R69.1 | R69.2 32.39,38.73 34.93,38.73 Q15.3
ADDR16
  Top 0.813: R70.1 R70.2
  Bottom 0.813: A.S2 8.26,48.26 14.61,48.26 R70.1 | R70.2 27.94,46.35 27.94,45.09 31.75,40.64 33.02,40.01 34.29,40.01 35.56,41.27 36.2,43.18 37.47,44.45 Q17.3
ADDR17
  Top 0.813: R71.1 R71.2
  Bottom 0.813: A.U2 8.89,55.24 R71.1 | Q21.3 R71.2
CLR_FLG  (via drill 0.81)
  Top 0.813: v77.47,82.55 v87.63,82.55
  Bottom 0.813: B.D2 8.89,83.19 14.61,83.19 15.88,80.49 17.62,73.66 18.42,71.75 19.05,70.48 21.43,69.22 23.5,68.58 36.2,68.58 38.1,66.67 39.37,64.14 44.13,60.96 48.9,60.96 54.61,63.5 60.96,63.5 R1.2 64.14,62.87 66.04,65.41 67.31,69.22 68.58,71.75 71.76,74.93 74.93,76.2 D1.A 75.57,79.38 75.57,81.28 76.84,82.55 v77.47,82.55 | v87.63,82.55 D2.C 89.54,87 90.81,94.61 Q1.3 93.98,102.23 94.62,103.5 95.89,104.78 97.79,105.41 D4.A
ENA  (via drill 0.81)
  Top 0.813: v70.49,41.27 62.23,41.27 60.96,42.55 60.96,48.9 63.5,51.44 v65.41,51.44 73.66,51.44 76.2,48.9 v85.09,48.9
  Bottom 0.813: D17.A D27.A D40.A D54.A D78.A | A.P2 8.89,42.55 14.61,42.55 D78.A | D78.A D93.A 23.5,57.15 25.4,59.69 28.58,62.23 31.75,63.5 35.56,63.5 38.74,61.59 41.28,59.69 43.18,58.42 50.17,58.42 55.88,60.96 59.69,60.96 62.87,59.05 65.41,55.24 v65.41,51.44 | D37.A 68.58,40.01 v70.49,41.27 R18.2 76.2,39.37 D28.C | D29.A 95.25,81.92 Q6.3 92.71,80.01 90.17,76.83 88.9,75.56 85.09,75.56 82.55,73.03 82.55,66.04 83.19,63.5 83.82,61.59 83.82,57.78 83.82,52.7 85.09,50.16 v85.09,48.9
ENB
  Bottom 0.813: A.E2 9.53,16.51 14.61,16.51 14.76,16.35 15.24,14.76 17.78,10.16 19.69,7.62 23.18,5.87 79.85,5.87 81.92,7.62 81.92,9.53 82.55,11.43 83.19,14.61 83.19,21.91 85.09,24.13 85.09,26.67 86.36,28.57 D63.C 89.54,29.84 90.17,31.75 92.08,33.66 Q14.3 95.25,37.47 98.43,38.1 101.6,40.01 102.87,40.64 105.41,40.64 | 105.41,40.64 106.68,39.37 106.68,37.47 104.14,34.29 R38.2 D87.A | 105.41,40.64 106.05,41.91 107.16,43.18 109.22,43.66 110.49,44.93 110.49,46.99 109.86,48.26 108.59,48.9 106.68,49.53 105.41,50.8 105.41,51.44 106.68,52.7 106.68,54.61 106.05,55.24 104.78,55.88 102.87,55.88 100.33,54.61 97.16,53.18 92.71,53.18 91.44,54.45 91.44,56.52 92.08,57.15 93.98,58.42 97.16,59.69 D56.A
GND  (via drill 0.81, 0.81 pad 0.25)
  Top 0.813: v19.69,66.04 v33.66,59.69 v44.45,66.67 | v25.4,22.86 22.86,22.86 22.86,21.59 20.32,19.05 19.05,19.05 15.24,15.24 v15.24,8.89 | v49.53,104.14 v59.69,104.14 | v62.87,102.87 v73.03,102.87 | v87.63,124.46 v77.47,124.46
  Bottom 0.813: Q4.1 Q7.1 35.56,17.78 31.75,17.78 28.58,20.32 26.95,23.03 | 26.95,23.03 26.67,23.5 26.67,35.56 | Q9.1 Q15.1 34.93,33.02 32.39,33.02 28.58,35.56 26.67,35.56 | Q17.1 Q21.1 34.93,48.9 33.66,48.26 28.58,50.8 26.67,50.8 | 26.67,50.8 26.67,35.56 | 26.67,50.8 26.67,55.88 27.94,57.15 v33.66,59.69 | B.C2 8.89,80.01 14.61,80.01 14.92,79.38 16.51,73.03 v19.69,66.04 | A.C2 8.89,10.16 14.61,10.16 v15.24,8.89 15.88,7.62 18.42,5.08 19.69,4.45 22.23,3.33 81.28,3.33 87.63,5.71 105.41,5.71 107.95,6.99 109.86,8.26 110.49,9.53 110.49,10.79 109.86,13.34 110.49,15.24 110.49,17.78 | v25.4,22.86 26.67,22.86 26.95,23.03 | Q20.1 Q19.1 | Q19.1 95.25,18.41 99.06,18.41 102.24,20.32 104.78,20.32 108.59,17.78 110.49,17.78 | Q19.1 93.98,22.23 95.25,24.77 95.25,27.94 Q14.1 | Q12.1 95.89,57.15 100.33,59.69 102.87,60.96 106.05,64.77 107.95,66.04 109.22,66.67 | 109.22,66.67 108.59,68.58 | 108.59,68.58 97.16,68.58 93.98,69.22 Q5.1 | 109.22,66.67 110.49,64.77 110.49,51.44 111.13,48.9 111.76,46.99 111.76,44.45 111.13,43.18 110.49,39.37 110.49,17.78 | Q16.1 Q18.1 40.01,91.44 38.74,93.98 38.74,98.42 39.37,100.97 Q13.1 41.28,103.5 Q11.1 46.99,104.14 v49.53,104.14 | Q8.1 60.33,127 61.6,128.27 67.95,128.27 | 67.95,128.27 74.3,128.27 75.57,127 75.57,125.73 76.84,124.46 v77.47,124.46 78.11,124.46 79.38,123.83 80.65,121.92 81.28,120.65 81.92,118.11 C8.1 | 67.95,128.27 68.58,122.56 69.22,118.11 69.22,107.31 70.49,104.78 v73.03,102.87 D107.A | v62.87,102.87 v59.69,104.14 57.79,102.23 56.52,100.33 54.61,97.79 54.61,88.9 53.98,83.82 53.34,81.92 53.34,74.3 52.07,72.39 Q10.1 C7.1 v44.45,66.67
  Bottom 0.813: 108.59,68.58 109.22,70.48 111.13,73.03 111.13,76.2 112.4,79.38 112.4,84.45 111.76,85.72 111.13,87.63 111.13,88.9 110.49,90.81 110.49,92.71 110.81,93.98 110.81,95.25 D3.C | D3.C 102.87,99.69 Q2.1 Q1.1 92.08,92.71 92.08,88.9 Q6.1 | D3.C 109.86,101.6 110.81,104.3 110.49,107.31 110.49,109.22 111.13,111.76 111.13,114.3 110.49,116.84 110.49,121.92 111.13,127 110.49,128.27 109.22,128.91 92.08,128.91 90.81,127.64 Q3.1 v87.63,124.46
IO_PWR_CLR  (via drill 0.81)
  Top 0.813: v34.29,96.52 v44.45,96.52
  Bottom 0.813: B.T2 8.89,121.28 13.97,121.28 17.15,124.46 24.92,128.27 37.47,128.27 38.74,127.64 40.01,125.09 40.01,123.83 38.1,119.38 37.47,117.47 37.47,113.67 39.37,109.22 39.37,106.05 37.47,103.5 37.47,98.42 35.56,96.52 v34.29,96.52 | v44.45,96.52 D43.A
IO_SYNC
  Bottom 0.813: A.H2 8.89,22.86 14.61,22.86 16.51,20.32 17.15,17.14 20.96,10.79 24.13,8.41 76.52,8.41 D101.A
N$1
  Bottom 0.813: Q4.2 41.28,12.7 D19.A R13.1
N$2
  Bottom 0.813: C1.1 95.25,93.34 Q1.2 D3.A R2.1
N$3
  Bottom 0.813: D1.C 88.9,78.74 92.08,82.55 94.62,83.82 97.95,86.36 R21.2 | D35.C 104.78,93.98 106.05,93.34 106.68,92.71 106.68,90.81 104.78,87.63 R21.2 | R21.2 109.22,86.36 110.49,85.09 110.49,83.19 D33.C
N$4
  Bottom 0.813: D6.C 100.97,110.49 104.14,110.49 106.05,109.22 107.95,107.31 D4.C R4.2
N$5
  Bottom 0.813: Q2.3 90.17,101.6 90.17,96.52 88.9,93.98 R3.2 C1.2 D5.C
N$6
  Bottom 0.813: R5.1 97.16,107.31 Q2.2 94.62,108.58 95.89,110.49 D7.A D8.C
N$7
  Bottom 0.813: D6.A D7.C
N$8
  Bottom 0.813: R7.2 102.87,123.19 100.33,125.09 97.79,126.36 C2.2 93.35,121.92 91.44,118.75 90.17,116.2 90.17,112.55 88.74,111.12 85.73,111.12 83.82,109.86 81.92,107.31 80.65,103.5 79.38,101.6 D9.A D14.C
N$9
  Bottom 0.813: C2.1 108.59,125.73 D8.A 106.68,115.57 104.14,116.2 100.97,117.47 97.79,117.47 96.52,116.2 95.25,114.3 93.98,111.12 92.71,108.58 90.81,106.68 D10.C R6.2 D9.C
N$10
  Bottom 0.813: D96.C R59.2 64.14,98.42 65.41,97.16 65.41,94.61 63.5,93.34 62.23,93.34 D92.A C6.1 D97.C
N$11
  Bottom 0.813: D11.A 64.14,83.19 65.41,83.82 66.04,85.09 66.04,86.36 D12.C
N$12
  Bottom 0.813: D13.C R8.2 D11.C
N$13
  Bottom 0.813: D12.A 78.11,91.44 79.38,92.08 81.28,93.98 81.92,97.16 81.92,102.23 82.55,104.78 83.19,106.68 84.46,108.58 86.36,109.86 89.22,109.86 90.17,110.49 90.81,111.12 91.44,112.24 91.44,114.3 92.71,117.47 Q3.2 95.25,123.19 96.52,124.46 98.43,124.46 100.33,123.19 102.87,120.02 R9.1
N$14
  Bottom 0.813: Q3.3 97.16,120.65 97.16,119.38 95.25,116.84 93.98,114.94 92.08,110.49 90.17,108.58 87,108.58 85.73,107.95 84.46,106.05 83.82,104.78 83.82,100.97 85.09,97.79 86.36,96.52 | 86.36,96.52 R10.2 D14.A | 86.36,96.52 85.09,94.61 83.82,92.08 83.82,85.09 84.46,82.55 86.36,80.64 D15.C
N$15
  Bottom 0.813: B.E2 8.26,87 13.97,87 14.92,85.88 15.56,83.98 17.15,80.64 18.73,74.14 19.69,71.91 21.59,70.48 26.67,69.85 36.83,69.85 39.37,67.31 40.32,65.09 44.45,62.23 48.26,62.23 53.98,64.77 55.88,65.41 D16.A D20.A 64.14,66.67 66.04,70.48 66.04,74.3 63.5,77.47 D13.A
N$16
  Bottom 0.813: Q15.2 R39.1 D60.A
N$17
  Bottom 0.813: D20.C D23.A 80.01,60.96 80.01,45.72 78.74,43.81 C3.2 D22.C R14.2
N$18
  Bottom 0.813: D18.C 40.64,14.61 36.83,15.88 34.29,15.88 D17.C R11.2
N$19
  Bottom 0.813: D18.A D19.C
N$20
  Bottom 0.813: Q6.2 92.71,84.45 93.98,85.09 95.89,86.36 D36.A R22.1
N$21
  Bottom 0.813: D27.C R17.2 36.2,21.59 38.74,21.59 D30.C
N$22
  Bottom 0.813: D31.C 55.88,22.86 56.52,22.23 56.52,18.41 55.88,17.78 D30.A
N$23
  Bottom 0.813: Q7.2 R19.1 D31.A
N$24
  Bottom 0.813: R27.1 45.72,31.11 46.99,29.84 46.99,27.3 45.72,26.04 D42.A 41.91,28.57 38.1,30.48 Q9.2
N$25
  Bottom 0.813: D42.C D41.A
N$26
  Bottom 0.813: R25.2 D40.C 36.83,32.38 37.47,32.38 42.55,29.84 D41.C
N$27
  Bottom 0.813: D60.C D57.A
N$28
  Bottom 0.813: D54.C R35.2 36.83,37.47 38.1,38.1 39.37,37.47 D57.C
N$29
  Bottom 0.813: R51.1 45.72,46.99 46.99,45.72 46.99,43.18 45.72,41.91 D80.A 42.55,44.45 40.01,46.35 Q17.2
N$30
  Bottom 0.813: D79.A D80.C
N$31
  Bottom 0.813: D79.C 40.64,47.62 38.1,48.9 36.83,48.9 33.02,45.72 D78.C R49.2
N$32
  Bottom 0.813: D95.A R60.1 41.91,54.61 Q21.2
N$33
  Bottom 0.813: D95.C D94.A
N$34
  Bottom 0.813: R58.2 D93.C 34.93,54.61 37.47,54.61 40.01,53.34 D94.C
N$35
  Bottom 0.813: C3.1 D22.A 85.09,43.81 84.46,41.27 84.46,32.38 82.55,27.3 82.55,25.4 80.65,22.86 80.65,18.41 D21.C R12.2
N$36
  Bottom 0.813: R16.1 D23.C 86.36,63.5 85.73,64.14 85.09,67.31 85.09,71.75 86.36,73.03 90.17,73.03 93.35,73.66 Q5.2 D26.A
N$37
  Bottom 0.813: 100.33,78.74 102.24,80.64 106.05,83.19 107.32,84.45 D29.C | 100.33,78.74 R15.2 100.97,72.39 99.06,71.12 97.16,70.48 95.25,70.48 93.35,72.39 90.17,71.75 D24.C | 100.33,78.74 D25.C
N$38
  Bottom 0.813: R62.2 100.97,6.99 93.98,6.99 | Q20.3 93.98,6.99 | 93.98,6.99 86.36,6.99 85.09,8.26 85.09,10.79 85.73,11.43 D84.A D44.A D21.A D98.A D100.C
N$39
  Bottom 0.813: D26.C D25.A
N$40  (via drill 0.81 pad 0.25)
  Top 0.813: v62.87,74.3 65.41,73.03 v75.57,73.03 | v77.47,68.58 v87.63,68.58
  Bottom 0.813: Q10.3 59.06,73.03 D74.A v62.87,74.3 | R31.2 v75.57,73.03 D24.A v77.47,68.58 | v87.63,68.58 D49.C 92.08,65.41 95.25,64.77 D50.A
N$41
  Bottom 0.813: Q8.2 58.42,128.27 60.96,129.54 74.93,129.54 76.84,128.27 R24.1 D39.A
N$42
  Bottom 0.813: D38.A D39.C
N$43
  Bottom 0.813: R23.2 D34.C D38.C
N$44
  Bottom 0.813: D45.C 58.42,86.36 57.15,88.9 57.15,92.08 58.42,93.98 D43.C R28.2
N$46
  Bottom 0.813: D46.C D45.A
N$47
  Bottom 0.813: Q10.2 55.88,72.39 55.88,78.11 57.79,80.64 R29.1 D46.A
N$48  (via drill 0.81)
  Top 0.813: v24.77,124.46 20.32,124.46 19.05,123.19 19.05,118.11 20.32,116.84 v42.55,116.84
  Bottom 0.813: B.M2 8.89,105.41 13.97,105.41 15.24,106.68 15.24,113.03 16.51,116.84 18.42,120.02 D51.C 22.23,122.56 v24.77,124.46 | Q11.3 41.91,111.76 41.91,115.57 v42.55,116.84 44.45,116.2 46.99,114.94 48.26,113.67 R34.2
N$49
  Bottom 0.813: R37.1 Q11.2 43.82,107.95 41.91,109.22 40.64,110.49 39.37,114.3 39.37,117.47 40.01,119.38 41.91,121.28 43.18,121.92 D59.A
N$50
  Bottom 0.813: D58.A D59.C
N$51
  Bottom 0.813: D62.C R36.2 D58.C
N$52
  Bottom 0.813: D62.A D61.C R40.2 Q13.3
N$53  (via drill 0.81)
  Top 0.813: v44.45,113.67 v34.29,113.67
  Bottom 0.813: v34.29,113.67 Q13.2 36.2,104.14 36.2,102.87 35.56,101.6 34.29,100.97 33.66,100.97 D66.A | R43.1 46.99,111.12 v44.45,113.67
N$54
  Bottom 0.813: D65.A D66.C
N$55
  Bottom 0.813: D69.C D70.C 29.85,83.82 26.04,86.36 25.4,87.63 25.4,92.08 27.31,95.89 27.94,98.42 28.58,99.69 29.85,101.6 | 29.85,101.6 D65.C | 29.85,101.6 28.58,103.5 R42.2
N$56
  Bottom 0.813: B.H2 8.26,93.34 13.97,93.34 15.24,92.08 17.15,87 19.05,82.55 20.32,81.28 D69.A D73.A
N$57
  Bottom 0.813: B.F2 9.53,90.17 13.97,90.17 14.92,89.06 18.26,81.28 19.05,78.11 19.69,76.83 D75.A
N$58
  Bottom 0.813: D77.A R48.1 35.72,84.45 35.72,86.36 Q16.2
N$59
  Bottom 0.813: D76.A D77.C
N$60
  Bottom 0.813: R47.2 D75.C D73.C D82.C 36.2,78.74 D76.C D74.C
N$61
  Bottom 0.813: D91.A 36.83,92.08 38.74,90.17 38.74,88.27 37.78,86.84 37.78,84.93 39.37,83.82 40.64,83.82 43.18,86.36 Q18.2 44.45,88.9 43.82,90.17 | D92.C 46.36,91.44 43.82,90.17 | R57.1 42.55,100.97 40.64,99.06 40.64,94.61 43.82,90.17
N$62
  Bottom 0.813: D90.A 43.18,99.06 41.91,97.79 41.91,95.25 43.18,93.98 D91.C
N$63
  Bottom 0.813: D106.C 71.76,106.05 70.49,107.95 70.49,109.86 71.76,111.12 D105.A
N$64
  Bottom 0.813: R45.1 D68.A Q14.2 92.71,32.38 91.12,30.8 90.81,28.57 90.17,27.3 88.9,26.67 D71.C
N$65
  Bottom 0.813: D35.A D36.C
N$66
  Bottom 0.813: D104.A D105.C
N$67
  Bottom 0.813: D103.C D102.A
N$68
  Bottom 0.813: D101.C 90.81,8.89 93.03,10.32 94.93,10.32 97.79,8.26 99.7,8.26 105.41,10.79 106.68,12.06 106.68,13.97 R63.2 D102.C
N$69
  Bottom 0.813: Q20.2 92.08,12.06 96.52,12.06 D103.A R64.1
N$70  (via drill 0.81)
  Top 0.813: v34.29,119.38 v44.45,119.38
  Bottom 0.813: B.S2 8.89,118.11 13.97,118.11 15.88,120.02 17.78,123.19 25.08,127 36.83,127 38.1,125.73 38.1,123.19 36.83,121.28 35.56,120.02 v34.29,119.38 | v44.45,119.38 47.63,116.2 50.17,114.94 52.07,113.67 52.71,111.76 52.71,104.14 49.53,100.97 D99.A D96.A
N$71
  Bottom 0.813: D86.C 29.85,86.36 27.94,87 26.67,88.27 26.67,90.17 27.94,92.71 28.58,94.61 29.85,96.52 R56.2 D90.C
N$72
  Bottom 0.813: D48.C 88.9,34.29 89.54,35.56 90.17,38.1 90.81,39.37 93.35,41.27 94.62,42.55 95.25,44.45 93.98,46.35 91.44,48.9 90.81,50.16 Q12.2 93.35,51.44 96.52,51.44 D53.A R33.1
N$73
  Bottom 0.813: C4.1 59.69,34.29 60.33,32.38 61.6,31.11 D47.A 64.14,30.48 65.41,28.57 67.95,24.13 69.22,17.78 70.49,14.61 71.76,12.7 R26.2 D44.C
N$74
  Bottom 0.813: D48.A C4.2 D37.C 71.76,38.1 70.49,36.83 69.85,35.56 69.85,33.66 70.49,31.75 71.76,30.48 | R30.2 71.76,20.32 70.49,22.23 69.85,23.5 69.85,27.3 70.49,28.57 71.76,30.48 | 71.76,30.48 D47.C
N$75
  Bottom 0.813: D68.C D67.A
N$76
  Bottom 0.813: D53.C D52.A
N$77
  Bottom 0.813: D52.C R32.2 D56.C D50.C
N$78
  Bottom 0.813: D67.C R44.2 D64.C
N$79
  Bottom 0.813: D71.A 76.84,26.67 74.93,27.94 | 74.93,27.94 74.93,32.38 74.3,33.02 D72.C | 74.93,27.94 C5.1 D83.C R46.2
N$80
  Bottom 0.813: Q19.2 D89.A R55.1
N$81
  Bottom 0.813: C5.2 D83.A 64.77,25.4 66.04,23.5 66.68,21.59 67.95,16.51 69.22,13.34 71.76,10.16 R52.2 D84.C
N$82
  Bottom 0.813: D88.C R54.2 D87.C
N$83
  Bottom 0.813: D89.C D88.A
N$85
  Bottom 0.813: D97.A C6.2 75.57,89.53 79.38,89.53 81.28,87.63 82.55,83.19 82.55,78.11 81.28,73.03 81.28,66.04 81.28,65.41 82.55,61.59 82.55,59.69 82.55,47.62 83.19,39.37 83.19,36.2 82.55,31.75 81.28,27.3 81.28,26.67 81.28,26.04 79.38,23.5 79.38,20.32 D98.C R61.2
REQ  (via drill 0.81)
  Top 0.813: v49.53,117.47 v59.69,117.47 | v62.87,118.75 v73.03,118.75
  Bottom 0.813: B.U2 8.89,124.46 13.97,124.46 17.15,126.36 20.48,127.48 24.77,129.54 43.18,129.54 46.36,128.27 49.53,125.73 52.71,121.92 52.71,119.38 51.44,117.47 | 51.44,117.47 v49.53,117.47 | v59.69,117.47 v62.87,118.75 | 51.44,117.47 52.07,116.2 53.98,113.67 54.61,111.76 54.61,104.14 52.07,101.6 52.07,90.17 50.8,88.9 Q18.3 46.99,85.72 45.09,83.82 43.18,83.82 41.91,82.55 41.91,80.01 43.18,78.74 D82.A | D34.A 76.84,116.84 v73.03,118.75 R50.2 D81.C
RQ
  Bottom 0.813: B.V2 8.89,128.27 19.05,128.27 24.61,130.81 46.99,130.81 49.53,130.18 51.44,128.91 52.71,127 Q8.3
SELECT
  Bottom 0.813: A.D2 8.89,13.34 14.61,13.34 17.15,8.26 19.05,6.35 22.86,4.6 80.65,4.6 83.19,6.99 83.19,8.89 84.46,13.97 84.46,21.43 86.2,23.5 87,24.13 90.81,24.13 Q19.3
VCC  (via drill 0.81)
  Top 0.813: v113.67,69.85 100.33,69.85 96.52,67.31 92.71,62.23 89.54,57.78 77.47,57.78 v74.93,59.05 v59.06,57.15
  Bottom 0.813: R13.2 50.8,13.97 50.8,20.32 | 50.8,20.32 R19.2 | R39.2 50.8,38.73 | 50.8,38.73 50.8,31.11 | 50.8,31.11 50.8,20.32 | R27.2 50.8,31.11 | R51.2 50.8,46.99 | 50.8,46.99 50.8,38.73 | 50.8,46.99 50.8,52.07 53.34,54.61 R60.2 v59.06,57.15 | A.A2 8.89,3.81 15.88,3.81 17.15,2.54 20.96,0.79 83.19,0.79 88.9,3.17 105.41,3.17 112.4,4.45 115.57,5.71 116.84,6.99 116.84,10.79 R64.2 116.84,16.51 116.84,19.68 R55.2 116.84,26.67 116.84,34.92 R45.2 116.84,41.27 116.84,50.16 R33.2 116.84,57.15 116.84,64.14 v113.67,69.85 115.57,72.39 116.84,74.3 116.84,87.63 116.21,89.53 R22.2 R2.2 116.84,100.33 116.84,104.14 R5.2 R9.2 116.84,120.65 116.84,125.09 115.57,127 113.03,129.54 110.49,130.18 92.08,130.18 90.17,129.54 R24.2 86.36,127 80.01,129.54 76.2,130.81 56.52,130.81 55.25,130.18 54.61,128.91 54.61,127 56.52,124.46 56.52,123.19 55.88,121.28 55.25,120.02 55.25,116.2 56.52,112.39 57.15,111.12 58.42,109.22 R43.2 R37.2 R57.2 53.34,99.69 53.34,88.9 52.71,88.27 52.71,83.82 50.8,81.28 R29.2 R48.2 | v74.93,59.05 R16.2

### Text on the board
Bottom: W104C